# Altium project BRK7360.PRJPCB
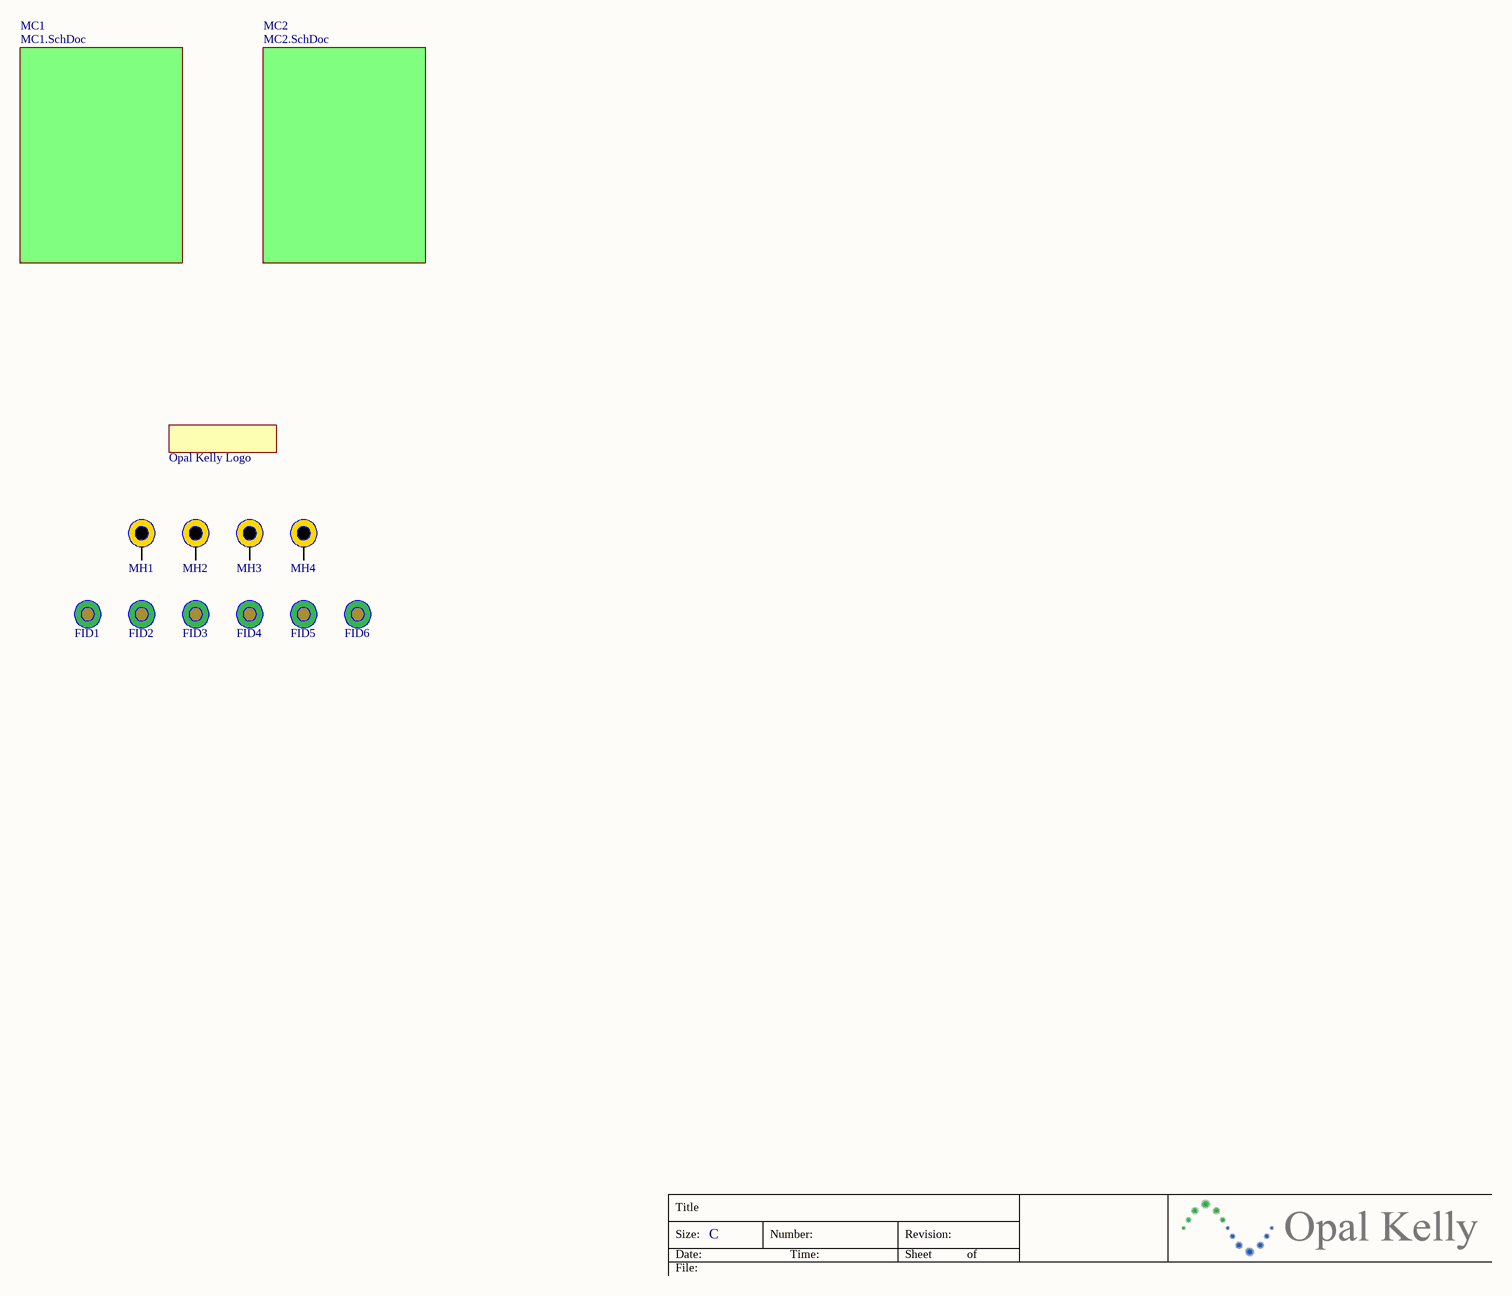
[diagram p0: Top.SchDoc]
3 sheets, 110 parts. Net scope: global (net labels, ports and power ports of the same name join across sheets).
Board file: BRK7360.PcbDoc
Sheets:
  Top.SchDoc
    MC1 = MC1.SchDoc
    MC2 = MC2.SchDoc

## Sheet Top.SchDoc: XEM7360 Breakout Board - Top
size C; DrawnBy: Nick Kettman; Organization: Opal Kelly; Address1: 13500 SW 72nd Ave Ste 100; Address2: Portland, OR 97223; Address4: http://www.opalkelly.com/; DocumentNumber: xxx; Revision: A; SheetNumber: 1; SheetTotal: 3; ProjectName: BRK7360

### Parts
*1  Opal Kelly Logo  [okLogo-23x5]
FID1  FIDUCIAL  [FID1MM/2MM-SS]  (value not drawn)
FID2  FIDUCIAL  [FID1MM/2MM-SS]  (value not drawn)
FID3  FIDUCIAL  [FID1MM/2MM-SS]  (value not drawn)
FID4  FIDUCIAL  [FID1MM/2MM-SS]  (value not drawn)
FID5  FIDUCIAL  [FID1MM/2MM-SS]  (value not drawn)
FID6  FIDUCIAL  [FID1MM/2MM-SS]  (value not drawn)
MH1  MTG  [MTG-2.7/5.0-PTH]  (value not drawn)
MH2  MTG  [MTG-2.7/5.0-PTH]  (value not drawn)
MH3  MTG  [MTG-2.7/5.0-PTH]  (value not drawn)
MH4  MTG  [MTG-2.7/5.0-PTH]  (value not drawn)

### Sub-sheets
MC1 = MC1.SchDoc: no entries
MC2 = MC2.SchDoc: no entries

### Nets

Not connected (* = marked no-connect by the designer): MH1 1; MH2 1; MH3 1; MH4 1

### Notes on the sheet
- Title
- Size:
- Date:
- File:
- C
- Number:
- Time:
- Revision:
- Sheet
- of

### Library data of the parts
*1 = OKLOGO
FID1-FID6 = FIDUCIAL: PCB fiducial
MH1-MH4 = MTG: Mounting hole

## Sheet MC1.SchDoc: XEM7360 Breakout Board - MC1
size C; Author: Nick Kettman; Organization: Opal Kelly; Address1: 13500 SW 72nd Ave Ste 100; Address2: Portland, OR 97223; Address4: http://www.opalkelly.com; DocumentNumber: xxx; Revision: 1; SheetNumber: 2; SheetTotal: 3; PageSetup: Record=PageOptions|CenterHorizontal=True|CenterVertical=True|PrintScale=0.53|XCorrection=1.00|YCorrection=1.00|PrintKind=0|BorderSize=5000000|LeftOffset=0|BottomOffset=0|Orientation=2|PaperLength=1000|PaperWidth=1000|Scale=100|PaperSource=7|PrintQuality=-4|MediaType=1|DitherType=10|PaperKind=Letter|PrintScaleMode=1
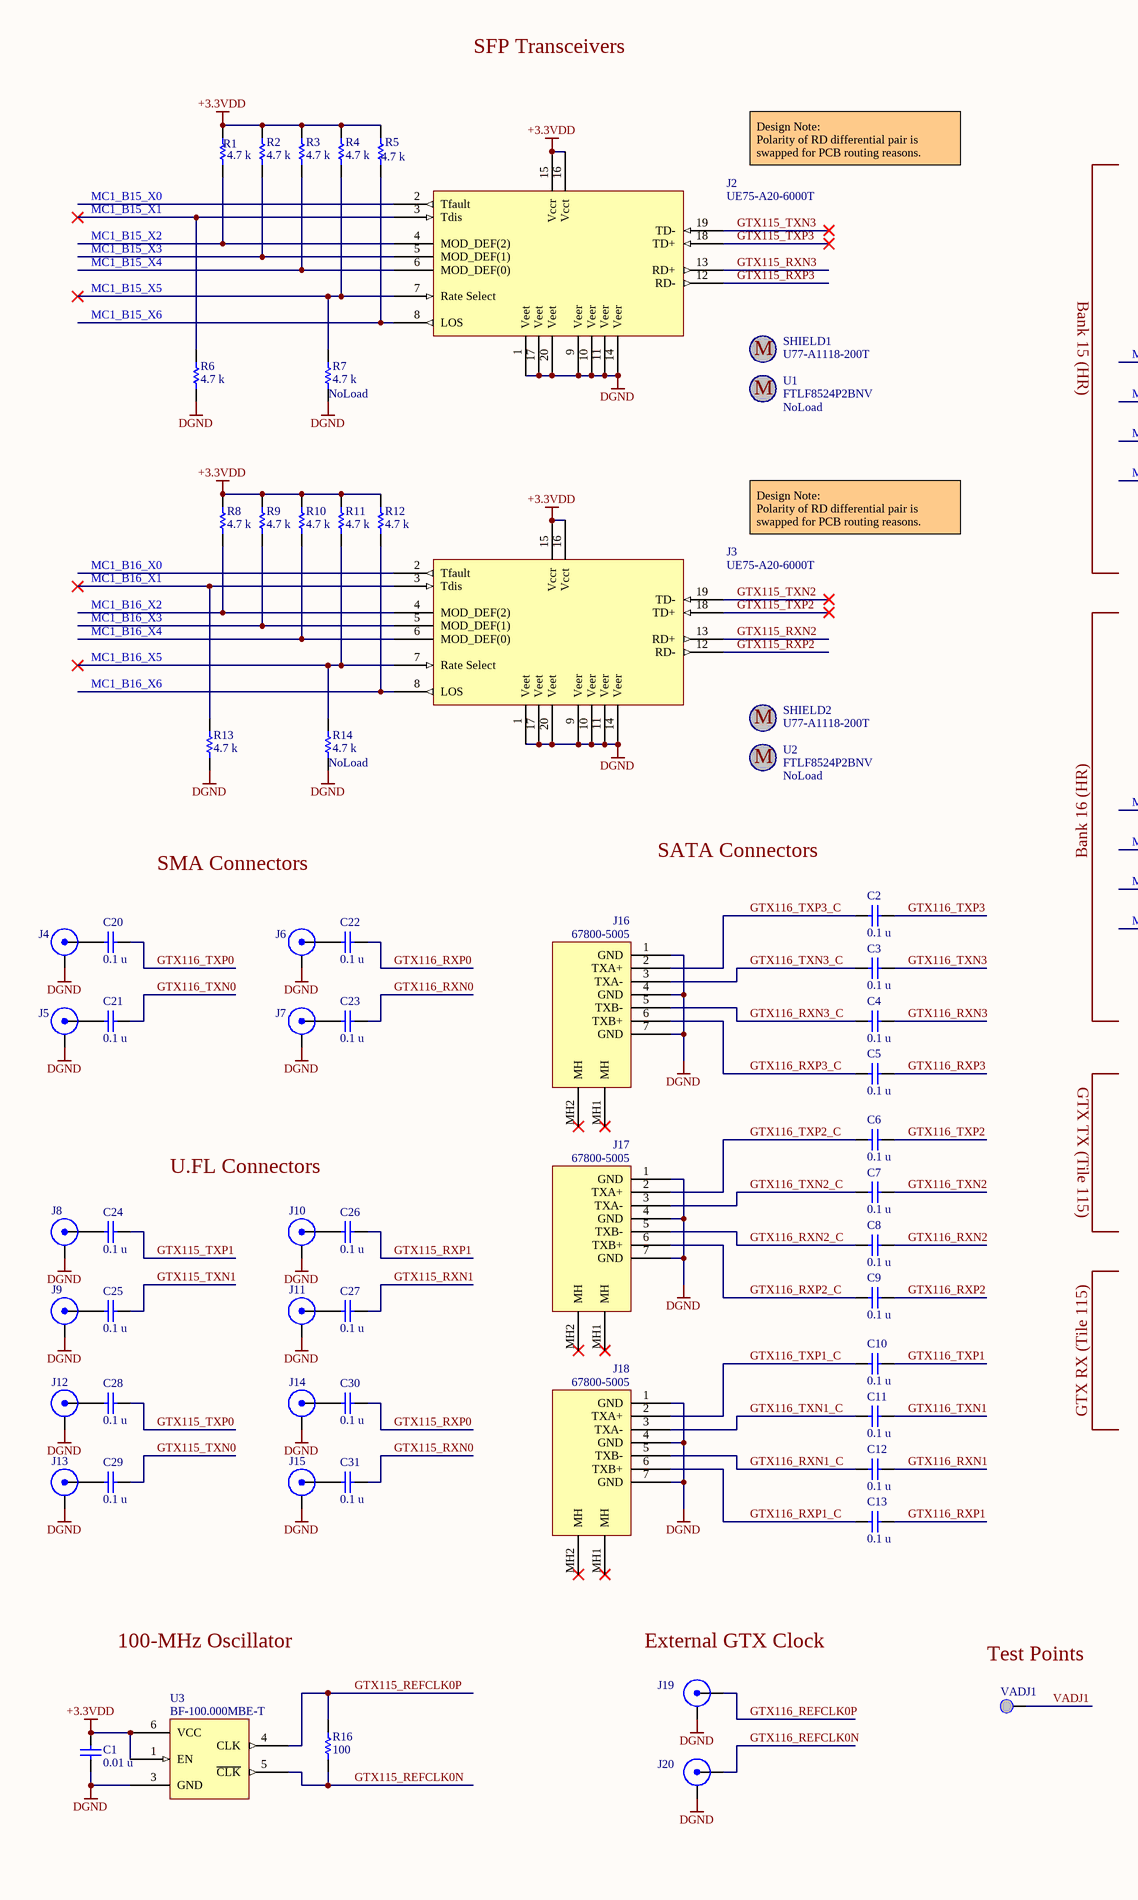
[diagram p1: MC1.SchDoc, left]
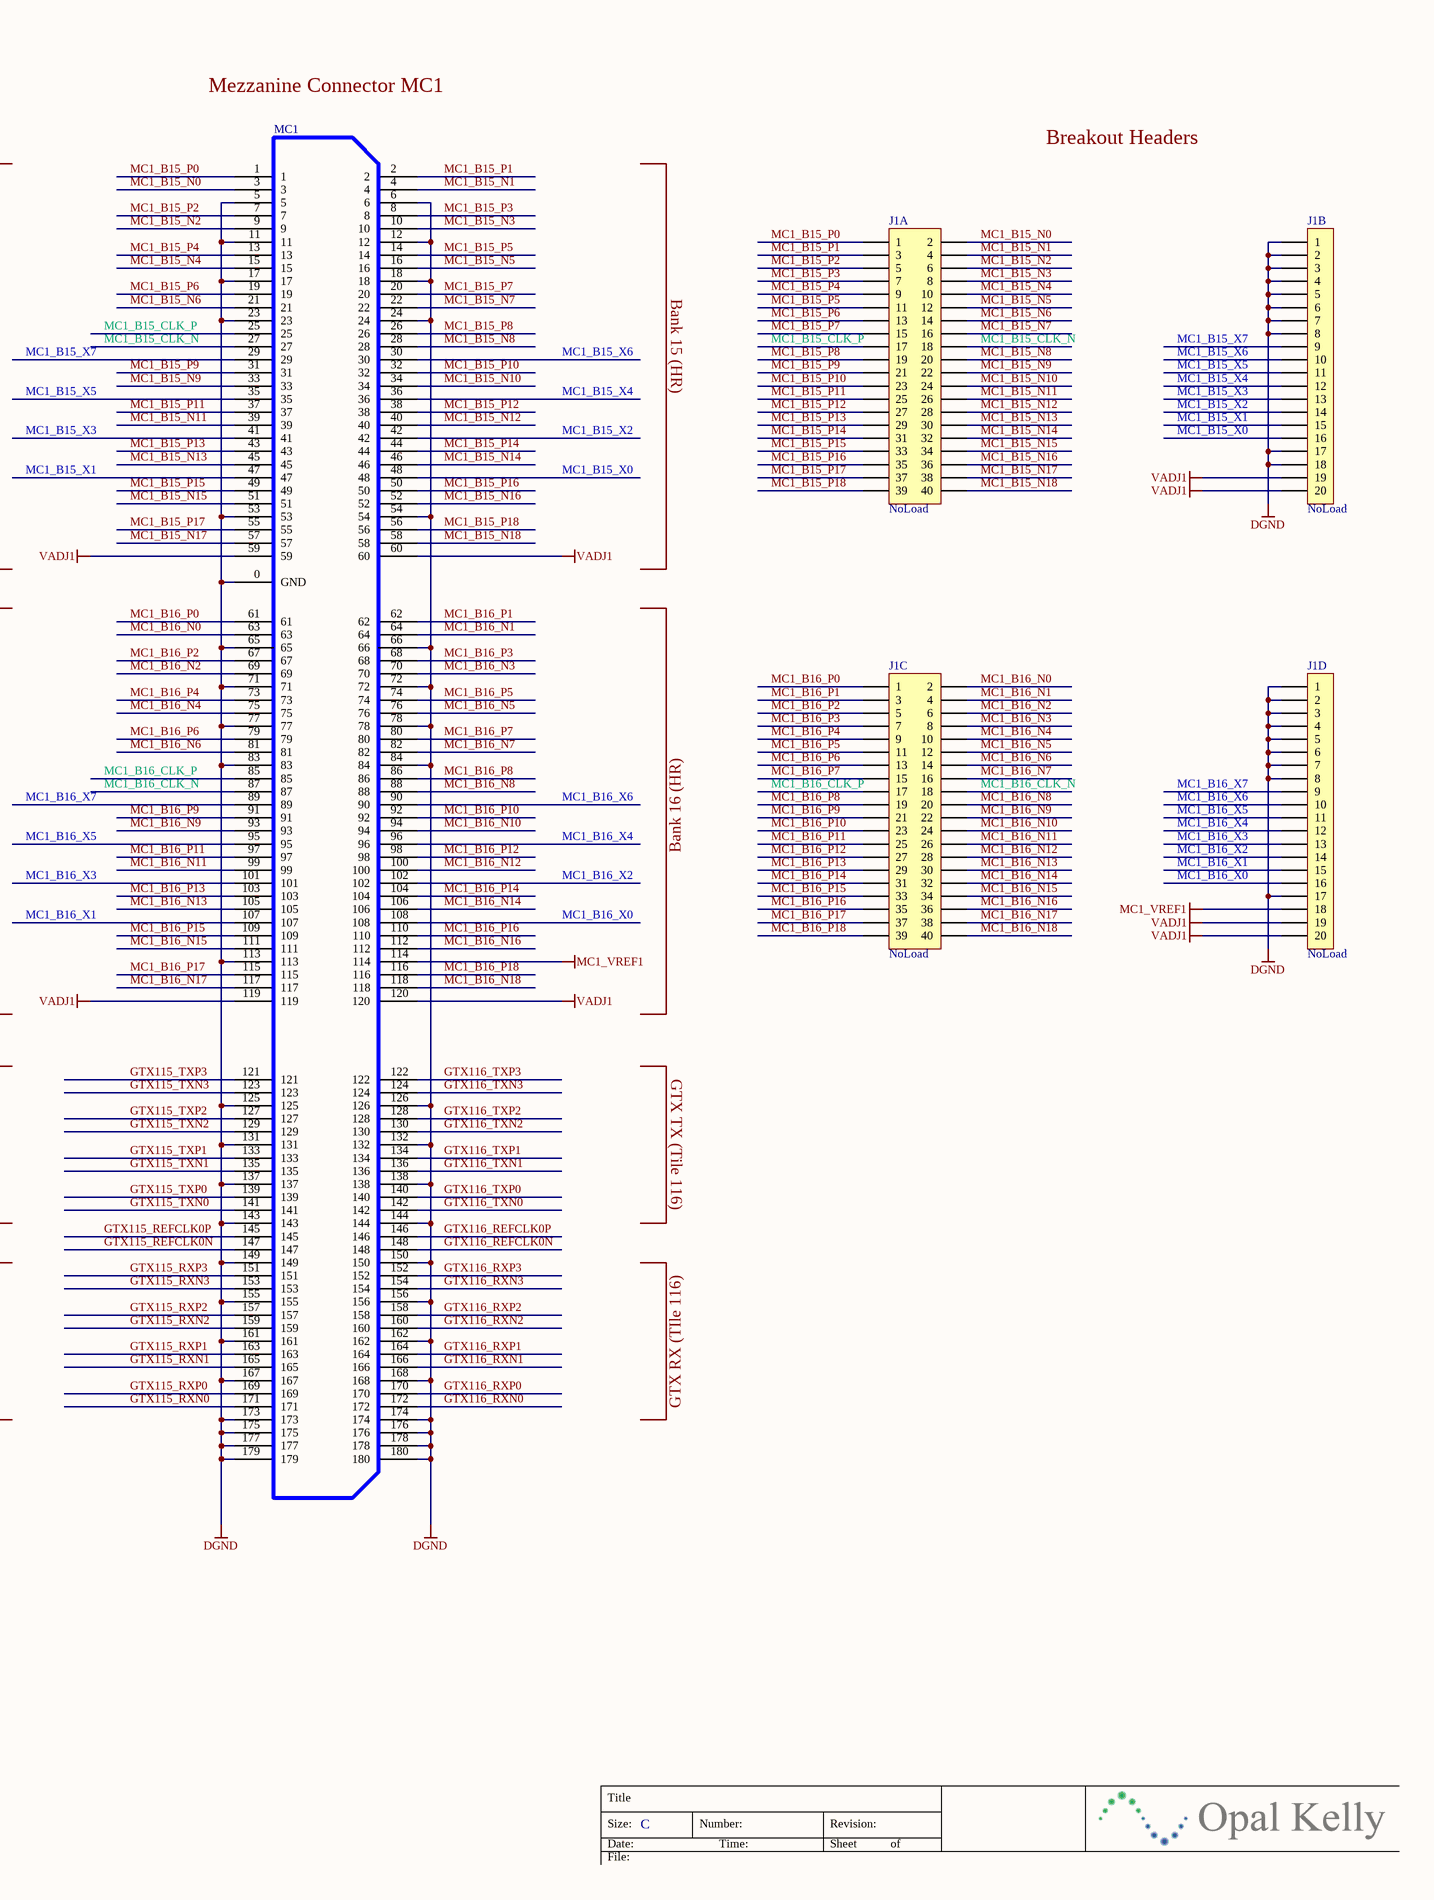
[diagram p2: MC1.SchDoc, right]

### Parts
C1  value 0.01 u  [CAPC1005N]  (hidden comment: C0402C103K4RACTU)
C2  value 0.1 u  [CAPC1005N]  (hidden comment: C0402C104K8PACTU)
C3  value 0.1 u  [CAPC1005N]  (hidden comment: C0402C104K8PACTU)
C4  value 0.1 u  [CAPC1005N]  (hidden comment: C0402C104K8PACTU)
C5  value 0.1 u  [CAPC1005N]  (hidden comment: C0402C104K8PACTU)
C6  value 0.1 u  [CAPC1005N]  (hidden comment: C0402C104K8PACTU)
C7  value 0.1 u  [CAPC1005N]  (hidden comment: C0402C104K8PACTU)
C8  value 0.1 u  [CAPC1005N]  (hidden comment: C0402C104K8PACTU)
C9  value 0.1 u  [CAPC1005N]  (hidden comment: C0402C104K8PACTU)
C10  value 0.1 u  [CAPC1005N]  (hidden comment: C0402C104K8PACTU)
C11  value 0.1 u  [CAPC1005N]  (hidden comment: C0402C104K8PACTU)
C12  value 0.1 u  [CAPC1005N]  (hidden comment: C0402C104K8PACTU)
C13  value 0.1 u  [CAPC1005N]  (hidden comment: C0402C104K8PACTU)
C20  value 0.1 u  [CAPC1005N]  (hidden comment: C0402C104K8PACTU)
C21  value 0.1 u  [CAPC1005N]  (hidden comment: C0402C104K8PACTU)
C22  value 0.1 u  [CAPC1005N]  (hidden comment: C0402C104K8PACTU)
C23  value 0.1 u  [CAPC1005N]  (hidden comment: C0402C104K8PACTU)
C24  value 0.1 u  [CAPC1005N]  (hidden comment: C0402C104K8PACTU)
C25  value 0.1 u  [CAPC1005N]  (hidden comment: C0402C104K8PACTU)
C26  value 0.1 u  [CAPC1005N]  (hidden comment: C0402C104K8PACTU)
C27  value 0.1 u  [CAPC1005N]  (hidden comment: C0402C104K8PACTU)
C28  value 0.1 u  [CAPC1005N]  (hidden comment: C0402C104K8PACTU)
C29  value 0.1 u  [CAPC1005N]  (hidden comment: C0402C104K8PACTU)
C30  value 0.1 u  [CAPC1005N]  (hidden comment: C0402C104K8PACTU)
C31  value 0.1 u  [CAPC1005N]  (hidden comment: C0402C104K8PACTU)
J1A  0877584016  [HDR2X20-2MM]  (value not drawn)
J1B  Header, 20-Pin, Single Row  [HDR1X20-2MM]  (value not drawn)
J1C  0877584016  [HDR2X20-2MM]  (value not drawn)
J1D  Header, 20-Pin, Single Row  [HDR1X20-2MM]  (value not drawn)
J2  UE75-A20-6000T  [SFP_RCPT_20_CAGE]
J3  UE75-A20-6000T  [SFP_RCPT_20_CAGE]
J4  TXP0  [SMA]  (value not drawn)
J5  TXN0  [SMA]  (value not drawn)
J6  RXP0  [SMA]  (value not drawn)
J7  RXN0  [SMA]  (value not drawn)
J8  TXP1  [UFL-R-SMT-1]  (value not drawn)
J9  TXN1  [UFL-R-SMT-1]  (value not drawn)
J10  RXP1  [UFL-R-SMT-1]  (value not drawn)
J11  RXN1  [UFL-R-SMT-1]  (value not drawn)
J12  TXP0  [UFL-R-SMT-1]  (value not drawn)
J13  TXN0  [UFL-R-SMT-1]  (value not drawn)
J14  RXP0  [UFL-R-SMT-1]  (value not drawn)
J15  RXN0  [UFL-R-SMT-1]  (value not drawn)
J16  67800-5005  [MOLEX-67800-5005]
J17  67800-5005  [MOLEX-67800-5005]
J18  67800-5005  [MOLEX-67800-5005]
J19  901-144-8RFX  [SMA]  (value not drawn)
J20  901-144-8RFX  [SMA]  (value not drawn)
MC1  QTH-090-01-F-D-A  [QTH-090-01-X-D]  (value not drawn)
R1  value 4.7 k  [RESC1005N]  (hidden comment: CRCW04024K70JNED)
R2  value 4.7 k  [RESC1005N]  (hidden comment: CRCW04024K70JNED)
R3  value 4.7 k  [RESC1005N]  (hidden comment: CRCW04024K70JNED)
R4  value 4.7 k  [RESC1005N]  (hidden comment: CRCW04024K70JNED)
R5  value 4.7 k  [RESC1005N]  (hidden comment: CRCW04024K70JNED)
R6  value 4.7 k  [RESC1005N]  (hidden comment: CRCW04024K70JNED)
R7  value 4.7 k  [RESC1005N]  (hidden comment: CRCW04024K70JNED)
R8  value 4.7 k  [RESC1005N]  (hidden comment: CRCW04024K70JNED)
R9  value 4.7 k  [RESC1005N]  (hidden comment: CRCW04024K70JNED)
R10  value 4.7 k  [RESC1005N]  (hidden comment: CRCW04024K70JNED)
R11  value 4.7 k  [RESC1005N]  (hidden comment: CRCW04024K70JNED)
R12  value 4.7 k  [RESC1005N]  (hidden comment: CRCW04024K70JNED)
R13  value 4.7 k  [RESC1005N]  (hidden comment: CRCW04024K70JNED)
R14  value 4.7 k  [RESC1005N]  (hidden comment: CRCW04024K70JNED)
R16  value 100  [RESC1608N]  (hidden comment: CRCW0603100RFKEA)
SHIELD1  U77-A1118-200T  (mechanical)
SHIELD2  U77-A1118-200T  (mechanical)
TP1  VADJ1  [TP_MED]
U1  FTLF8524P2BNV  (mechanical)
U2  FTLF8524P2BNV  (mechanical)
U3  BF-100.000MBE-T  [OSC_SMD6_5x7]

### Nets
+3.3VDD: C1.2 J2.15(Vccr) J2.16(Vcct) J3.15(Vccr) J3.16(Vcct) R1.2 R2.2 R3.2 R4.2 R5.2 R8.1 R9.1 R10.1 R11.1 R12.1 U3.1(EN) U3.6(VCC)
DGND: C1.1 J1B.1 J1B.2 J1B.3 J1B.4 J1B.5 J1B.6 J1B.7 J1B.8 J1B.17 J1B.18 J1D.1 J1D.2 J1D.3 J1D.4 J1D.5 J1D.6 J1D.7 J1D.8 J1D.17 J2.1(Veet) J2.9(Veer) J2.10(Veer) J2.11(Veer) J2.14(Veer) J2.17(Veet) J2.20(Veet) J3.1(Veet) J3.9(Veer) J3.10(Veer) J3.11(Veer) J3.14(Veer) J3.17(Veet) J3.20(Veet) J4.2(GND) J5.2(GND) J6.2(GND) J7.2(GND) J8.2(GND) J9.2(GND) J10.2(GND) J11.2(GND) J12.2(GND) J13.2(GND) J14.2(GND) J15.2(GND) J16.1(GND) J16.4(GND) J16.7(GND) J17.1(GND) J17.4(GND) J17.7(GND) J18.1(GND) J18.4(GND) J18.7(GND) J19.2(GND) J20.2(GND) MC1.0(GND) MC1.5 MC1.6 MC1.11 MC1.12 MC1.17 MC1.18 MC1.23 MC1.24 MC1.53 MC1.54 MC1.65 MC1.66 MC1.71 MC1.72 MC1.77 MC1.78 MC1.83 MC1.84 MC1.113 MC1.125 MC1.126 MC1.131 MC1.132 MC1.137 MC1.138 MC1.143 MC1.144 MC1.149 MC1.150 MC1.155 MC1.156 MC1.161 MC1.162 MC1.167 MC1.168 MC1.173 MC1.174 MC1.175 MC1.176 MC1.177 MC1.178 MC1.179 MC1.180 R6.2 R7.2 R13.2 R14.2 U3.3(GND)
MC1_VREF1: J1D.18 MC1.114
VADJ1: J1B.19 J1B.20 J1D.19 J1D.20 MC1.59 MC1.60 MC1.119 MC1.120 TP1.1(PIN)
GTX115_REFCLK0N: MC1.147 R16.1 U3.5(~{CLK})
GTX115_REFCLK0P: MC1.145 R16.2 U3.4(CLK)
GTX115_RXN0: C31.2 MC1.171
GTX115_RXN1: C27.2 MC1.165
GTX115_RXN2: J3.13(RD+) MC1.159
GTX115_RXN3: J2.13(RD+) MC1.153
GTX115_RXP0: C30.2 MC1.169
GTX115_RXP1: C26.2 MC1.163
GTX115_RXP2: J3.12(RD-) MC1.157
GTX115_RXP3: J2.12(RD-) MC1.151
GTX115_TXN0: C29.2 MC1.141
GTX115_TXN1: C25.2 MC1.135
GTX115_TXN2: J3.19(TD-) MC1.129
GTX115_TXN3: J2.19(TD-) MC1.123
GTX115_TXP0: C28.2 MC1.139
GTX115_TXP1: C24.2 MC1.133
GTX115_TXP2: J3.18(TD+) MC1.127
GTX115_TXP3: J2.18(TD+) MC1.121
GTX116_REFCLK0N: J20.1(SIGNAL) MC1.148
GTX116_REFCLK0P: J19.1(SIGNAL) MC1.146
GTX116_RXN0: C23.2 MC1.172
GTX116_RXN1: C12.2 MC1.166
GTX116_RXN1_C: C12.1 J18.5(TXB-)
GTX116_RXN2: C8.2 MC1.160
GTX116_RXN2_C: C8.1 J17.5(TXB-)
GTX116_RXN3: C4.2 MC1.154
GTX116_RXN3_C: C4.1 J16.5(TXB-)
GTX116_RXP0: C22.2 MC1.170
GTX116_RXP1: C13.2 MC1.164
GTX116_RXP1_C: C13.1 J18.6(TXB+)
GTX116_RXP2: C9.2 MC1.158
GTX116_RXP2_C: C9.1 J17.6(TXB+)
GTX116_RXP3: C5.2 MC1.152
GTX116_RXP3_C: C5.1 J16.6(TXB+)
GTX116_TXN0: C21.2 MC1.142
GTX116_TXN1: C11.2 MC1.136
GTX116_TXN1_C: C11.1 J18.3(TXA-)
GTX116_TXN2: C7.2 MC1.130
GTX116_TXN2_C: C7.1 J17.3(TXA-)
GTX116_TXN3: C3.2 MC1.124
GTX116_TXN3_C: C3.1 J16.3(TXA-)
GTX116_TXP0: C20.2 MC1.140
GTX116_TXP1: C10.2 MC1.134
GTX116_TXP1_C: C10.1 J18.2(TXA+)
GTX116_TXP2: C6.2 MC1.128
GTX116_TXP2_C: C6.1 J17.2(TXA+)
GTX116_TXP3: C2.2 MC1.122
GTX116_TXP3_C: C2.1 J16.2(TXA+)
MC1_B15_CLK_N: J1A.18 MC1.27
MC1_B15_CLK_P: J1A.17 MC1.25
MC1_B15_N0: J1A.2 MC1.3
MC1_B15_N1: J1A.4 MC1.4
MC1_B15_N2: J1A.6 MC1.9
MC1_B15_N3: J1A.8 MC1.10
MC1_B15_N4: J1A.10 MC1.15
MC1_B15_N5: J1A.12 MC1.16
MC1_B15_N6: J1A.14 MC1.21
MC1_B15_N7: J1A.16 MC1.22
MC1_B15_N8: J1A.20 MC1.28
MC1_B15_N9: J1A.22 MC1.33
MC1_B15_N10: J1A.24 MC1.34
MC1_B15_N11: J1A.26 MC1.39
MC1_B15_N12: J1A.28 MC1.40
MC1_B15_N13: J1A.30 MC1.45
MC1_B15_N14: J1A.32 MC1.46
MC1_B15_N15: J1A.34 MC1.51
MC1_B15_N16: J1A.36 MC1.52
MC1_B15_N17: J1A.38 MC1.57
MC1_B15_N18: J1A.40 MC1.58
MC1_B15_P0: J1A.1 MC1.1
MC1_B15_P1: J1A.3 MC1.2
MC1_B15_P2: J1A.5 MC1.7
MC1_B15_P3: J1A.7 MC1.8
MC1_B15_P4: J1A.9 MC1.13
MC1_B15_P5: J1A.11 MC1.14
MC1_B15_P6: J1A.13 MC1.19
MC1_B15_P7: J1A.15 MC1.20
MC1_B15_P8: J1A.19 MC1.26
MC1_B15_P9: J1A.21 MC1.31
MC1_B15_P10: J1A.23 MC1.32
MC1_B15_P11: J1A.25 MC1.37
MC1_B15_P12: J1A.27 MC1.38
MC1_B15_P13: J1A.29 MC1.43
MC1_B15_P14: J1A.31 MC1.44
MC1_B15_P15: J1A.33 MC1.49
MC1_B15_P16: J1A.35 MC1.50
MC1_B15_P17: J1A.37 MC1.55
MC1_B15_P18: J1A.39 MC1.56
MC1_B15_X0: J1B.16 J2.2(Tfault) MC1.48
MC1_B15_X1: J1B.15 J2.3(Tdis) MC1.47 R6.1
MC1_B15_X2: J1B.14 J2.4(MOD_DEF(2)) MC1.42 R1.1
MC1_B15_X3: J1B.13 J2.5(MOD_DEF(1)) MC1.41 R2.1
MC1_B15_X4: J1B.12 J2.6(MOD_DEF(0)) MC1.36 R3.1
MC1_B15_X5: J1B.11 J2.7(Rate_Select) MC1.35 R4.1 R7.1
MC1_B15_X6: J1B.10 J2.8(LOS) MC1.30 R5.1
MC1_B15_X7: J1B.9 MC1.29
MC1_B16_CLK_N: J1C.18 MC1.87
MC1_B16_CLK_P: J1C.17 MC1.85
MC1_B16_N0: J1C.2 MC1.63
MC1_B16_N1: J1C.4 MC1.64
MC1_B16_N2: J1C.6 MC1.69
MC1_B16_N3: J1C.8 MC1.70
MC1_B16_N4: J1C.10 MC1.75
MC1_B16_N5: J1C.12 MC1.76
MC1_B16_N6: J1C.14 MC1.81
MC1_B16_N7: J1C.16 MC1.82
MC1_B16_N8: J1C.20 MC1.88
MC1_B16_N9: J1C.22 MC1.93
MC1_B16_N10: J1C.24 MC1.94
MC1_B16_N11: J1C.26 MC1.99
MC1_B16_N12: J1C.28 MC1.100
MC1_B16_N13: J1C.30 MC1.105
MC1_B16_N14: J1C.32 MC1.106
MC1_B16_N15: J1C.34 MC1.111
MC1_B16_N16: J1C.36 MC1.112
MC1_B16_N17: J1C.38 MC1.117
MC1_B16_N18: J1C.40 MC1.118
MC1_B16_P0: J1C.1 MC1.61
MC1_B16_P1: J1C.3 MC1.62
MC1_B16_P2: J1C.5 MC1.67
MC1_B16_P3: J1C.7 MC1.68
MC1_B16_P4: J1C.9 MC1.73
MC1_B16_P5: J1C.11 MC1.74
MC1_B16_P6: J1C.13 MC1.79
MC1_B16_P7: J1C.15 MC1.80
MC1_B16_P8: J1C.19 MC1.86
MC1_B16_P9: J1C.21 MC1.91
MC1_B16_P10: J1C.23 MC1.92
MC1_B16_P11: J1C.25 MC1.97
MC1_B16_P12: J1C.27 MC1.98
MC1_B16_P13: J1C.29 MC1.103
MC1_B16_P14: J1C.31 MC1.104
MC1_B16_P15: J1C.33 MC1.109
MC1_B16_P16: J1C.35 MC1.110
MC1_B16_P17: J1C.37 MC1.115
MC1_B16_P18: J1C.39 MC1.116
MC1_B16_X0: J1D.16 J3.2(Tfault) MC1.108
MC1_B16_X1: J1D.15 J3.3(Tdis) MC1.107 R13.1
MC1_B16_X2: J1D.14 J3.4(MOD_DEF(2)) MC1.102 R8.2
MC1_B16_X3: J1D.13 J3.5(MOD_DEF(1)) MC1.101 R9.2
MC1_B16_X4: J1D.12 J3.6(MOD_DEF(0)) MC1.96 R10.2
MC1_B16_X5: J1D.11 J3.7(Rate_Select) MC1.95 R11.2 R14.1
MC1_B16_X6: J1D.10 J3.8(LOS) MC1.90 R12.2
MC1_B16_X7: J1D.9 MC1.89
NetC20_1: C20.1 J4.1(SIGNAL)
NetC21_1: C21.1 J5.1(SIGNAL)
NetC22_1: C22.1 J6.1(SIGNAL)
NetC23_1: C23.1 J7.1(SIGNAL)
NetC24_1: C24.1 J8.1(SIGNAL)
NetC25_1: C25.1 J9.1(SIGNAL)
NetC26_1: C26.1 J10.1(SIGNAL)
NetC27_1: C27.1 J11.1(SIGNAL)
NetC28_1: C28.1 J12.1(SIGNAL)
NetC29_1: C29.1 J13.1(SIGNAL)
NetC30_1: C30.1 J14.1(SIGNAL)
NetC31_1: C31.1 J15.1(SIGNAL)

Not connected (* = marked no-connect by the designer): J16 MH1(MH)* MH2(MH)*; J17 MH1(MH)* MH2(MH)*; J18 MH1(MH)* MH2(MH)*

### Notes on the sheet
- SFP Transceivers
- Mezzanine Connector MC1
- Design Note:
  Polarity of RD differential pair is swapped for PCB routing reasons.
- Breakout Headers
- Bank 15 (HR)
- Bank 16 (HR)
- SMA Connectors
- SATA Connectors
- GTX TX (Tile 115)
- GTX TX (Tile 116)
- U.FL Connectors
- GTX RX (Tile 115)
- GTX RX (TIle 116)
- 100-MHz Oscillator
- (near J19) External GTX Clock
- (near TP1) Test Points
- Title
- Size:
- Date:
- File:
- C
- Number:
- Time:
- Revision:
- Sheet
- of
- (in symbol 000985) M
- (in symbol 000987) M

### Library data of the parts
C1 = 000295: Ceramic Capacitor; Manufacturer: Kemet; partnumber: 000295; Description 2: SM-0402, 10%, 6.3V, X5R; ValueFloat: 1E-8; Tolerance (%): 10; Manufacturer_PN: C0402C103K4RACTU; updated_on: 2/12/2015 9:26:19 AM
C2-C13 C20-C31 = 000070: Ceramic capacitor; Manufacturer: Kemet; partnumber: 000070; Description 2: SM-0402, 10%, 10v; ValueFloat: 1E-7; Tolerance (%): 10; Manufacturer_PN: C0402C104K8PACTU; updated_on: 8/6/2015 11:41:11 AM
J1A J1C = 000583: 2mm header, 20x2, thru-hole; Manufacturer: Molex; partnumber: 000583; Manufacturer_PN: 0877584016; updated_on: 1/24/2015 12:30:40 PM; NoLoad: NoLoad
J1B J1D = 001334: 2mm header, 20x1, thru-hole; PartNumber: 001334; Manufacturer: 3M; Manufacturer_PN: 951120-8622-AR; x_lifecycle_status: Production; updated_on: 8/19/2015 3:11:41 PM; NoLoad: NoLoad
J2 J3 = 000986: SFP 20-POS Recepticle; Manufacturer: Amphenol; partnumber: 000986; Description 2: Right Angle, SMD, 15AU Gold; Manufacturer_PN: UE75-A20-6000T; updated_on: 1/24/2015 12:31:33 PM
J4-J7 = 000974: Straight SMA PCB Mount; Manufacturer: Amphenol; Manufacturer_PN: 901-144-8RFX; partnumber: 000974; updated_on: 1/24/2015 12:31:32 PM
J8-J15 = 001335: U.FL surface-mount coaxial connector; Manufacturer: Hirose; Manufacturer_PN: U.FL-R-SMT-1; partnumber: 001335; x_lifecycle_status: Production; updated_on: 8/20/2015 5:25:45 PM
J16-J18 = 000988: SATA 7-pin receptacle; Manufacturer: Molex; partnumber: 000988; Description 2: Vertical Mount, SMD, Latch, 15u Gold; x_lifecycle_status: Production; Manufacturer_PN: 67800-5005; updated_on: 3/13/2015 8:50:14 AM
J19 J20 = 000974: Straight SMA PCB Mount; Manufacturer: Amphenol; partnumber: 000974; Manufacturer_PN: 901-144-8RFX; updated_on: 1/24/2015 12:31:32 PM
MC1 = 000876: 0.5mm hi-speed, high-density header (Female); Manufacturer: Samtec; partnumber: 000876; Description 2: 180-pin, ground plane in middle; Manufacturer_PN: QTH-090-01-F-D-A; updated_on: 3/23/2015 1:16:30 PM
R1-R14 = 000754: Thick-film resistor; Manufacturer: Vishay; partnumber: 000754; Description 2: SM-0402, 5%, 1/16W; ValueFloat: 4700; Tolerance (%): 5; Manufacturer_PN: CRCW04024K70JNED; updated_on: 1/24/2015 12:31:02 PM
  R7 R14: NoLoad: NoLoad
R16 = 000789: Thick-film resistor; Manufacturer: Vishay; partnumber: 000789; Description 2: SM-0603, 1%, 1/10W; Tolerance (%): 1; Manufacturer_PN: CRCW0603100RFKEA; ValueFloat: 100; updated_on: 1/24/2015 12:31:07 PM
SHIELD1 SHIELD2 = 000987: SFP Single Cage; Manufacturer: Amphenol; partnumber: 000987; Description 2: Pressfit; x_lifecycle_status: Production; Manufacturer_PN: U77-A1118-200T; updated_on: 1/24/2015 12:31:33 PM
TP1 = 000265: Testpoint; Manufacturer: Keystone Electronics; Manufacturer_PN: 5007; partnumber: 000265; Description 2: 0.063 in. diameter, compact, White; updated_on: 1/24/2015 12:30:04 PM; NoLoad: NoLoad
U1 U2 = 000985: SFP Transceiver; Manufacturer: Finisar; partnumber: 000985; Description 2: 4.25Gb/s, Narrow Extraction Bail, Rate Selectable; Manufacturer_PN: FTLF8524P2BNV; updated_on: 8/14/2013 11:58:28 AM; NoLoad: NoLoad
U3 = 000846: 100 MHz LVDS oscillator; Manufacturer: TXC Corporation; partnumber: 000846; Description 2: 3.3v, 50ppm, industrial temp, 7mm x 5mm; Manufacturer_PN: BF-100.000MBE-T; updated_on: 10/13/2015 2:32:21 PM

## Sheet MC2.SchDoc: XEM7360 Breakout Board - MC2
size C; Author: Nick Kettman; Organization: Opal Kelly; Address1: 13500 SW 72nd Ave Ste 100; Address2: Portland, OR 97223; Address4: http://www.opalkelly.com; DocumentNumber: xxx; Revision: 1; SheetNumber: 3; SheetTotal: 3; PageSetup: Record=PageOptions|CenterHorizontal=True|CenterVertical=True|PrintScale=0.53|XCorrection=1.00|YCorrection=1.00|PrintKind=0|BorderSize=5000000|LeftOffset=0|BottomOffset=0|Orientation=2|PaperLength=1000|PaperWidth=1000|Scale=100|PaperSource=7|PrintQuality=-4|MediaType=1|DitherType=10|PaperKind=Letter|PrintScaleMode=1
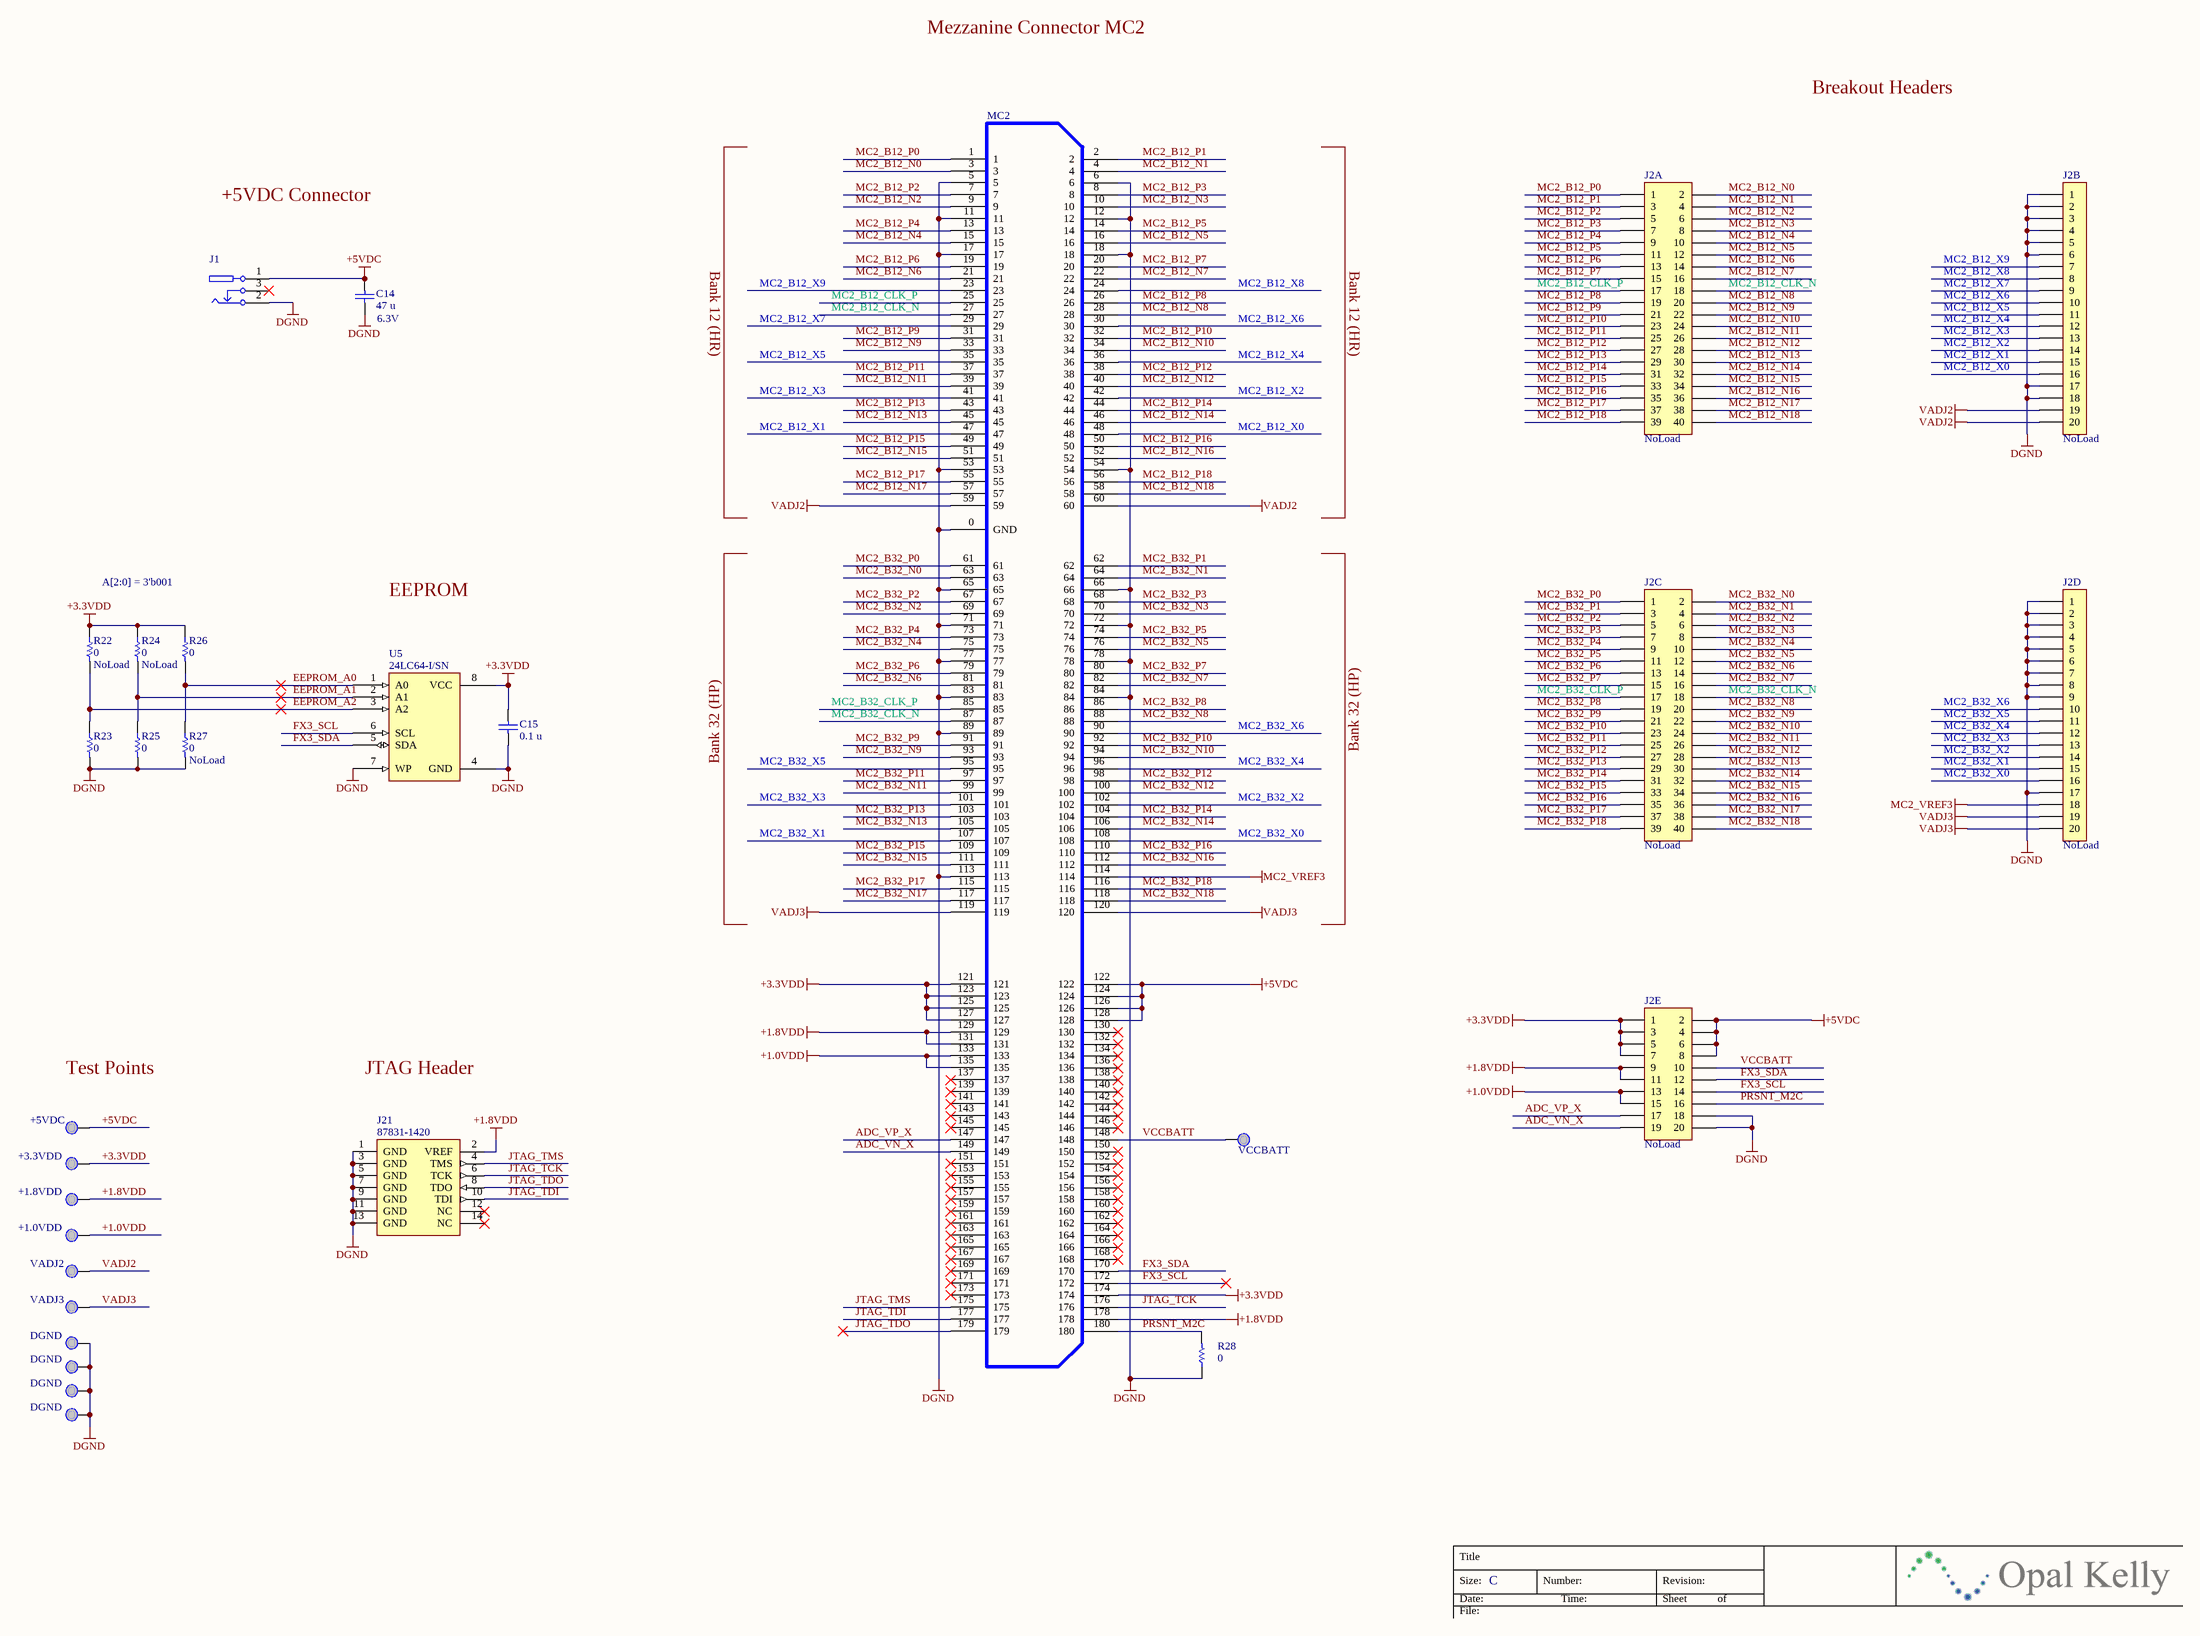
[diagram p3: MC2.SchDoc]

### Parts
C14  value 47 u  VoltageRating: 6.3V  [CAPC3216N]  (hidden comment: JMK316BJ476ML-T)
C15  value 0.1 u  [CAPC1005N]  (hidden comment: C0402C104K8PACTU)
J1  PJ-102AH  [CUI-PJ102A]  (value not drawn)
J2A  0877584016  [HDR2X20-2MM]  (value not drawn)
J2B  Header, 20-Pin, Single Row  [HDR1X20-2MM]  (value not drawn)
J2C  0877584016  [HDR2X20-2MM]  (value not drawn)
J2D  Header, 20-Pin, Single Row  [HDR1X20-2MM]  (value not drawn)
J2E  0877582016  [HDR2X10-2MM]  (value not drawn)
J21  87831-1420  [HDR2X7-2MM]
MC2  QTH-090-01-F-D-A  [QTH-090-01-X-D]  (value not drawn)
R22  value 0  [RESC1005N]  (hidden comment: CRCW04020000Z0ED)
R23  value 0  [RESC1005N]  (hidden comment: CRCW04020000Z0ED)
R24  value 0  [RESC1005N]  (hidden comment: CRCW04020000Z0ED)
R25  value 0  [RESC1005N]  (hidden comment: CRCW04020000Z0ED)
R26  value 0  [RESC1005N]  (hidden comment: CRCW04020000Z0ED)
R27  value 0  [RESC1005N]  (hidden comment: CRCW04020000Z0ED)
R28  value 0  [RESC1608N]  (hidden comment: CRCW06030000Z0EA)
TP2  +5VDC  [TP_MED]
TP3  +3.3VDD  [TP_MED]
TP4  +1.8VDD  [TP_MED]
TP5  +1.0VDD  [TP_MED]
TP6  VCCBATT  [TP_MED]
TP9  VADJ2  [TP_MED]
TP10  VADJ3  [TP_MED]
TP11  DGND  [TP_MED]
TP12  DGND  [TP_MED]
TP13  DGND  [TP_MED]
TP14  DGND  [TP_MED]
U5  24LC64-I/SN  [SO-G8]

### Nets
+1.0VDD: J2E.13 J2E.15 MC2.133 MC2.135 TP5.1(PIN)
+1.8VDD: J2E.9 J2E.11 J21.2(VREF) MC2.129 MC2.131 MC2.178 TP4.1(PIN)
+3.3VDD: C15.1 J2E.1 J2E.3 J2E.5 J2E.7 MC2.121 MC2.123 MC2.125 MC2.127 MC2.174 R22.1 R24.1 R26.1 TP3.1(PIN) U5.8(VCC)
+5VDC: C14.1 J1.1 J2E.2 J2E.4 J2E.6 J2E.8 MC2.122 MC2.124 MC2.126 MC2.128 TP2.1(PIN)
DGND: C14.2 C15.2 J1.2 J2B.1 J2B.2 J2B.3 J2B.4 J2B.5 J2B.6 J2B.17 J2B.18 J2D.1 J2D.2 J2D.3 J2D.4 J2D.5 J2D.6 J2D.7 J2D.8 J2D.9 J2D.17 J2E.18 J2E.20 J21.1(GND) J21.3(GND) J21.5(GND) J21.7(GND) J21.9(GND) J21.11(GND) J21.13(GND) MC2.0(GND) MC2.5 MC2.6 MC2.11 MC2.12 MC2.17 MC2.18 MC2.53 MC2.54 MC2.65 MC2.66 MC2.71 MC2.72 MC2.77 MC2.78 MC2.83 MC2.84 MC2.89 MC2.113 R23.2 R25.2 R27.2 R28.1 TP11.1(PIN) TP12.1(PIN) TP13.1(PIN) TP14.1(PIN) U5.4(GND) U5.7(WP)
MC2_VREF3: J2D.18 MC2.114
VADJ2: J2B.19 J2B.20 MC2.59 MC2.60 TP9.1(PIN)
VADJ3: J2D.19 J2D.20 MC2.119 MC2.120 TP10.1(PIN)
ADC_VN_X: J2E.19 MC2.149
ADC_VP_X: J2E.17 MC2.147
EEPROM_A0: R26.2 R27.1 U5.1(A0)
EEPROM_A1: R24.2 R25.1 U5.2(A1)
EEPROM_A2: R22.2 R23.1 U5.3(A2)
FX3_SCL: J2E.14 MC2.172 U5.6(SCL)
FX3_SDA: J2E.12 MC2.170 U5.5(SDA)
JTAG_TCK: J21.6(TCK) MC2.176
JTAG_TDI: J21.10(TDI) MC2.177
JTAG_TDO: J21.8(TDO) MC2.179
JTAG_TMS: J21.4(TMS) MC2.175
MC2_B12_CLK_N: J2A.18 MC2.27
MC2_B12_CLK_P: J2A.17 MC2.25
MC2_B12_N0: J2A.2 MC2.3
MC2_B12_N1: J2A.4 MC2.4
MC2_B12_N2: J2A.6 MC2.9
MC2_B12_N3: J2A.8 MC2.10
MC2_B12_N4: J2A.10 MC2.15
MC2_B12_N5: J2A.12 MC2.16
MC2_B12_N6: J2A.14 MC2.21
MC2_B12_N7: J2A.16 MC2.22
MC2_B12_N8: J2A.20 MC2.28
MC2_B12_N9: J2A.22 MC2.33
MC2_B12_N10: J2A.24 MC2.34
MC2_B12_N11: J2A.26 MC2.39
MC2_B12_N12: J2A.28 MC2.40
MC2_B12_N13: J2A.30 MC2.45
MC2_B12_N14: J2A.32 MC2.46
MC2_B12_N15: J2A.34 MC2.51
MC2_B12_N16: J2A.36 MC2.52
MC2_B12_N17: J2A.38 MC2.57
MC2_B12_N18: J2A.40 MC2.58
MC2_B12_P0: J2A.1 MC2.1
MC2_B12_P1: J2A.3 MC2.2
MC2_B12_P2: J2A.5 MC2.7
MC2_B12_P3: J2A.7 MC2.8
MC2_B12_P4: J2A.9 MC2.13
MC2_B12_P5: J2A.11 MC2.14
MC2_B12_P6: J2A.13 MC2.19
MC2_B12_P7: J2A.15 MC2.20
MC2_B12_P8: J2A.19 MC2.26
MC2_B12_P9: J2A.21 MC2.31
MC2_B12_P10: J2A.23 MC2.32
MC2_B12_P11: J2A.25 MC2.37
MC2_B12_P12: J2A.27 MC2.38
MC2_B12_P13: J2A.29 MC2.43
MC2_B12_P14: J2A.31 MC2.44
MC2_B12_P15: J2A.33 MC2.49
MC2_B12_P16: J2A.35 MC2.50
MC2_B12_P17: J2A.37 MC2.55
MC2_B12_P18: J2A.39 MC2.56
MC2_B12_X0: J2B.16 MC2.48
MC2_B12_X1: J2B.15 MC2.47
MC2_B12_X2: J2B.14 MC2.42
MC2_B12_X3: J2B.13 MC2.41
MC2_B12_X4: J2B.12 MC2.36
MC2_B12_X5: J2B.11 MC2.35
MC2_B12_X6: J2B.10 MC2.30
MC2_B12_X7: J2B.9 MC2.29
MC2_B12_X8: J2B.8 MC2.24
MC2_B12_X9: J2B.7 MC2.23
MC2_B32_CLK_N: J2C.18 MC2.87
MC2_B32_CLK_P: J2C.17 MC2.85
MC2_B32_N0: J2C.2 MC2.63
MC2_B32_N1: J2C.4 MC2.64
MC2_B32_N2: J2C.6 MC2.69
MC2_B32_N3: J2C.8 MC2.70
MC2_B32_N4: J2C.10 MC2.75
MC2_B32_N5: J2C.12 MC2.76
MC2_B32_N6: J2C.14 MC2.81
MC2_B32_N7: J2C.16 MC2.82
MC2_B32_N8: J2C.20 MC2.88
MC2_B32_N9: J2C.22 MC2.93
MC2_B32_N10: J2C.24 MC2.94
MC2_B32_N11: J2C.26 MC2.99
MC2_B32_N12: J2C.28 MC2.100
MC2_B32_N13: J2C.30 MC2.105
MC2_B32_N14: J2C.32 MC2.106
MC2_B32_N15: J2C.34 MC2.111
MC2_B32_N16: J2C.36 MC2.112
MC2_B32_N17: J2C.38 MC2.117
MC2_B32_N18: J2C.40 MC2.118
MC2_B32_P0: J2C.1 MC2.61
MC2_B32_P1: J2C.3 MC2.62
MC2_B32_P2: J2C.5 MC2.67
MC2_B32_P3: J2C.7 MC2.68
MC2_B32_P4: J2C.9 MC2.73
MC2_B32_P5: J2C.11 MC2.74
MC2_B32_P6: J2C.13 MC2.79
MC2_B32_P7: J2C.15 MC2.80
MC2_B32_P8: J2C.19 MC2.86
MC2_B32_P9: J2C.21 MC2.91
MC2_B32_P10: J2C.23 MC2.92
MC2_B32_P11: J2C.25 MC2.97
MC2_B32_P12: J2C.27 MC2.98
MC2_B32_P13: J2C.29 MC2.103
MC2_B32_P14: J2C.31 MC2.104
MC2_B32_P15: J2C.33 MC2.109
MC2_B32_P16: J2C.35 MC2.110
MC2_B32_P17: J2C.37 MC2.115
MC2_B32_P18: J2C.39 MC2.116
MC2_B32_X0: J2D.16 MC2.108
MC2_B32_X1: J2D.15 MC2.107
MC2_B32_X2: J2D.14 MC2.102
MC2_B32_X3: J2D.13 MC2.101
MC2_B32_X4: J2D.12 MC2.96
MC2_B32_X5: J2D.11 MC2.95
MC2_B32_X6: J2D.10 MC2.90
PRSNT_M2C: J2E.16 MC2.180 R28.2
VCCBATT: J2E.10 MC2.148 TP6.1(PIN)

Not connected (* = marked no-connect by the designer): J1 3*; J21 12(NC)* 14(NC)*; MC2 130* 132* 134* 136* 137* 138* 139* 140* 141* 142* 143* 144* 145* 146* 150* 151* 152* 153* 154* 155* 156* 157* 158* 159* 160* 161* 162* 163* 164* 165* 166* 167* 168* 169* 171* 173*

### Notes on the sheet
- Mezzanine Connector MC2
- Breakout Headers
- +5VDC Connector
- Bank 12 (HR)
- A[2:0] = 3'b001
- EEPROM
- Bank 32 (HP)
- Test Points
- JTAG Header
- Title
- Size:
- Date:
- File:
- C
- Number:
- Time:
- Revision:
- Sheet
- of

### Library data of the parts
C14 = 000570: Ceramic Capacitor; Manufacturer: Taiyo Yuden; partnumber: 000570; Description 2: 1206, 6.3V; ValueFloat: 4.7E-5; Tolerance (%): 20; Manufacturer_PN: JMK316BJ476ML-T; updated_on: 7/24/2015 11:01:17 AM
C15 = 000070: as C2 on sheet MC1; Manufacturer_PN: C0402C104K8PACTU; updated_on: 8/6/2015 11:41:11 AM
J1 = 000356: DC power connector - high current; Manufacturer: CUI Inc.; partnumber: 000356; Description 2: 2.1mm / 5.5mm; Manufacturer_PN: PJ-102AH; updated_on: 2/12/2015 4:53:15 PM
J2A J2C = 000583: as J1A on sheet MC1; Manufacturer_PN: 0877584016; updated_on: 1/24/2015 12:30:40 PM; NoLoad: NoLoad
J2B J2D = 001334: as J1B on sheet MC1; updated_on: 8/19/2015 3:11:41 PM; NoLoad: NoLoad
J2E = 001338: 2mm header, 10x2, thru-hole; Manufacturer: Molex; partnumber: 001338; Manufacturer_PN: 0877582016; updated_on: 8/25/2015 11:37:01 AM; NoLoad: NoLoad
J21 = 000541: 2mm header, shrouded; Manufacturer: Molex; partnumber: 000541; Description 2: Dual-row, 14-pos, Xilinx JTAG compatible; Manufacturer_PN: 87831-1420; updated_on: 7/22/2015 1:38:47 PM
MC2 = 000876: as MC1 on sheet MC1; Manufacturer_PN: QTH-090-01-F-D-A; updated_on: 3/23/2015 1:16:30 PM
R22-R27 = 000755: Thick-film resistor; Manufacturer: Vishay; partnumber: 000755; Description 2: SM-0402, 1%, 1/16W; Tolerance (%): 1; Manufacturer_PN: CRCW04020000Z0ED; ValueFloat: 0
  R22 R24 R27: updated_on: 10/13/2015 2:32:19 PM; NoLoad: NoLoad
  R23 R25 R26: updated_on: 7/7/2015 8:21:48 AM
R28 = 000411: Zero-ohm resistor; Manufacturer: Vishay; partnumber: 000411; Description 2: SM-0603, 1/10W, 20 mOhm max; Manufacturer_PN: CRCW06030000Z0EA; ValueFloat: 0; updated_on: 2/12/2015 9:26:27 AM
TP2-TP6 TP9-TP14 = 000265: as TP1 on sheet MC1; updated_on: 1/24/2015 12:30:04 PM; NoLoad: NoLoad
U5 = 000004: EEPROM; Manufacturer: Microchip; partnumber: 000004; Description 2: I2C, 8 kByte; Manufacturer_PN: 24LC64-I/SN; updated_on: 1/24/2015 12:29:45 PM

## Nets that join several sheets
+3.3VDD: MC1 (17 pins), MC2 (15 pins)
DGND: MC1 (106 pins), MC2 (59 pins)